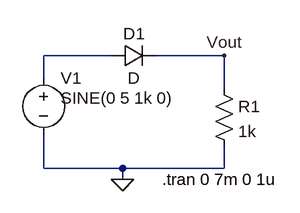
[diagram p0: schematic Task 1(b).asc]
Task 1(b).asc, the LTspice schematic file:
Version 4
SHEET 1 880 680
WIRE 176 80 80 80
WIRE 336 80 240 80
WIRE 80 112 80 80
WIRE 336 128 336 80
WIRE 80 240 80 192
WIRE 192 240 80 240
WIRE 336 240 336 208
WIRE 336 240 192 240
WIRE 192 256 192 240
FLAG 192 256 0
FLAG 336 80 Vout
SYMBOL diode 176 96 R270
WINDOW 0 32 32 VTop 2
WINDOW 3 0 32 VBottom 2
SYMATTR InstName D1
SYMBOL res 320 112 R0
SYMATTR InstName R1
SYMATTR Value 1k
SYMBOL voltage 80 96 R0
WINDOW 3 24 44 Left 2
WINDOW 123 0 0 Left 0
WINDOW 39 0 0 Left 0
SYMATTR InstName V1
SYMATTR Value SINE(0 5 1k 0)
TEXT 248 256 Left 2 !.tran 0 7m 0 1u

The netlist it stands for:
* Task 1(b).asc
D1 N001 Vout D
R1 Vout 0 1k
V1 N001 0 SINE(0 5 1k 0)
.model D D
.lib standard.dio
.tran 0 7m 0 1u
.backanno
.end